# Altium schematic sheet Piezo_Feedback.SchDoc
size 209 x 297 mm; SheetNumber: 4; SheetTotal: 5; PageSetup: Record=PageOptionsZCenterHorizontal=TrueZCenterVertical=TrueZPrintScale=0.95ZXCorrection=1.00ZYCorrection=1.00ZPrintKind=2ZBorderSize=5000000ZLeftOffset=0ZBottomOffset=0ZOrientation=1ZPaperLength=1000ZPaperWidth=1000ZScale=100ZPaperSource=7ZPrintQuality=600ZMediaType=1ZDitherType=10ZPaperKind=A4 (210 x 297 мм)ZPrintScaleMode=1
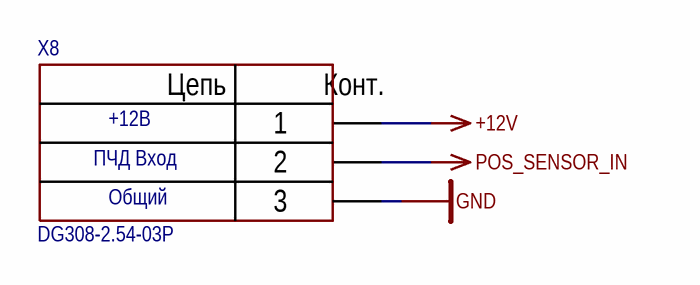
[diagram p0: Piezo_Feedback.SchDoc]

## Parts
X8  DG308-2.54-03P  Curciut 3: Общий  Curciut 2: ПЧД Вход  Curciut 1: +12В  [DG30825403P1400AH]

## Nets
+12V: X8.1
GND: X8.3
POS_SENSOR_IN: X8.2

## Notes on the sheet
- Перв. примен.
- Справ. №
- Подп. и дата
- Инв. № дубл.
- Взам. инв. №
- Изм.
- Лист
- № докум.
- Подп.
- Дата
- Инв. № подл.
- Копировал
- Формат А4
- (in symbol DG308-2.54-03P) Цепь; Конт.

## Library data of the parts
X8 = DG308-2.54-03P: Клеммник 3 конт. шаг 2.54 мм, вертик. на плату, H = 8.5 мм, провод под винт/микролифт (пров. 26-18AWG/ до 1.0 кв.мм), до 150В/6А, зеленый изол.; Supplier 1: https://www.chipdip.ru/product/308-031-14-dg308-2.54-03p-klemmnik-vintovoy-xinya-xinlaiya-10706